# Altium schematic sheet CSI.SchDoc
size A4
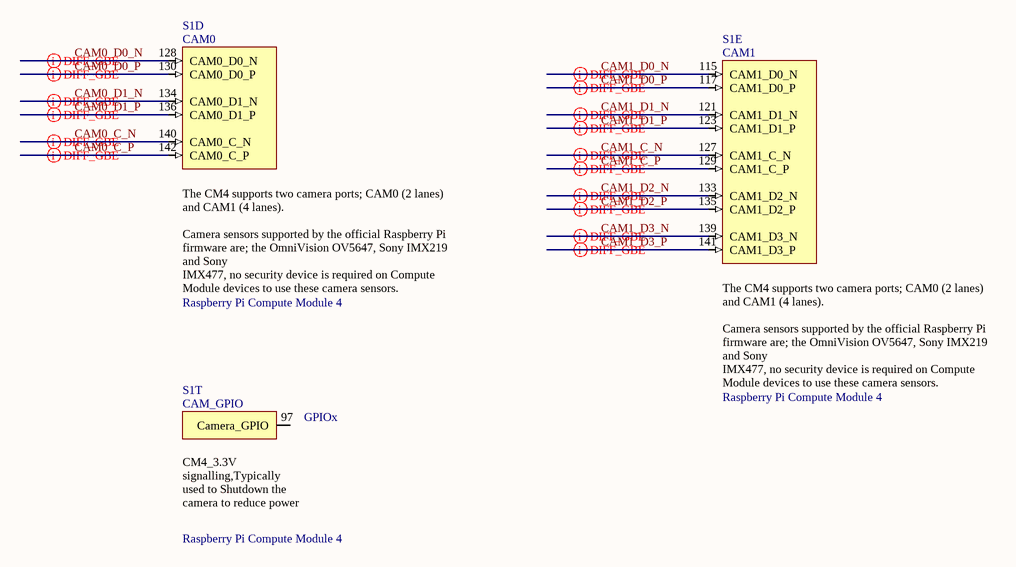
[diagram p0: CSI.SchDoc]

## Parts
S1  Raspberry Pi Compute Module 4  [CM4-F40C-100DS-0.4v_1.5mm_0mm]  (parts D,E,T of 21)

## Nets
CAM0_C_N: S1.140(CAM0_C_N)
CAM0_C_P: S1.142(CAM0_C_P)
CAM0_D0_N: S1.128(CAM0_D0_N)
CAM0_D0_P: S1.130(CAM0_D0_P)
CAM0_D1_N: S1.134(CAM0_D1_N)
CAM0_D1_P: S1.136(CAM0_D1_P)
CAM1_C_N: S1.127(CAM1_C_N)
CAM1_C_P: S1.129(CAM1_C_P)
CAM1_D0_N: S1.115(CAM1_D0_N)
CAM1_D0_P: S1.117(CAM1_D0_P)
CAM1_D1_N: S1.121(CAM1_D1_N)
CAM1_D1_P: S1.123(CAM1_D1_P)
CAM1_D2_N: S1.133(CAM1_D2_N)
CAM1_D2_P: S1.135(CAM1_D2_P)
CAM1_D3_N: S1.139(CAM1_D3_N)
CAM1_D3_P: S1.141(CAM1_D3_P)

Not connected (* = marked no-connect by the designer): S1 97(Camera_GPIO)

## Layout directives
differential pair; differential pair class DIFF_100Ohm_MIPI; differential pair class DIFF_MIPI; net class MIPI_1Gbps: CAM0_C_N, CAM0_C_P, CAM0_D0_N, CAM0_D0_P, CAM0_D1_N, CAM0_D1_P, CAM1_C_N, CAM1_C_P, CAM1_D0_N, CAM1_D0_P, CAM1_D1_N, CAM1_D1_P, CAM1_D2_N, CAM1_D2_P, CAM1_D3_N, CAM1_D3_P

## Notes on the sheet
- Title
- Size:
- Date:
- A4
- Number:
- Time:
- Revision:
- Sheet
- of
- Q-Wave Systems Co.,Ltd
- 65/2 Moo 1 Beung
- Sriracha Chonburi
- Thailand
- File:
- (in symbol CM4, part D) CAM0; The CM4 supports two camera ports; CAM0 (2 lanes) and CAM1 (4 lanes). / Camera sensors supported by the official Raspberry Pi firmware are; the OmniVision OV5647, Sony IMX219 and Sony / IMX477, no security device is required on Compute Module devices to use these camera sensors.
- (in symbol CM4, part E) CAM1; The CM4 supports two camera ports; CAM0 (2 lanes) and CAM1 (4 lanes). / Camera sensors supported by the official Raspberry Pi firmware are; the OmniVision OV5647, Sony IMX219 and Sony / IMX477, no security device is required on Compute Module devices to use these camera sensors.
- (in symbol CM4, part T) CAM_GPIO; GPIOx; CM4_3.3V signalling,Typically used to Shutdown the camera to reduce power

## Library data of the parts
S1 = CM4: Raspberry Pi Compute Module 4 by Amornthep Phunsin